# EAGLE schematic Temperature_sensor (EAGLE 7.7.0)
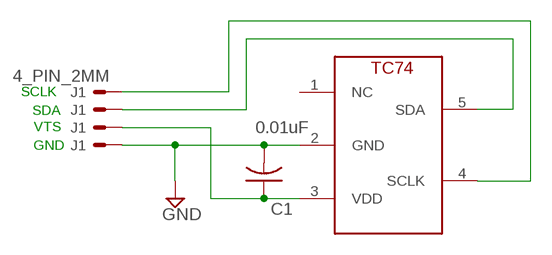
[diagram p0: schematic, sheet 1]

## Parts
C1  0.01uF  C-USC0805  [C0805]
J1  4_PIN_2MM  [2MM_4PIN_LARGE]
S1  TC74  [SOT23-5L]

## Nets
GND: C1.2 J1.8(S3) S1.2(GND)
N$2: C1.1 J1.6(S2) S1.3(VDD)
N$3: J1.4(S1) S1.5(SDA)
N$4: J1.2(S) S1.4(SCLK)
Unconnected: S1.1(NC)

## Notes on the sheet
- SCLK
- SDA
- VTS
- GND

## Library data of the parts
C1 = rcl:C-US: CAPACITOR, American symbol
J1 = Mine:4_PIN_2MM
S1 = Mine:TC74